# Altium project HAB-Main-Flight-Computer-Card-Template.PrjPcb (part 2 of 4)

## Sheet NetworkSwitch.SchDoc: Main Flight Computer Ethernet Switch
size A2; Revision: 1A; SheetNumber: 3; SheetTotal: 7; Organization: Altium Limited; Address1: Matthew Glazer; Address2: Design Engineer
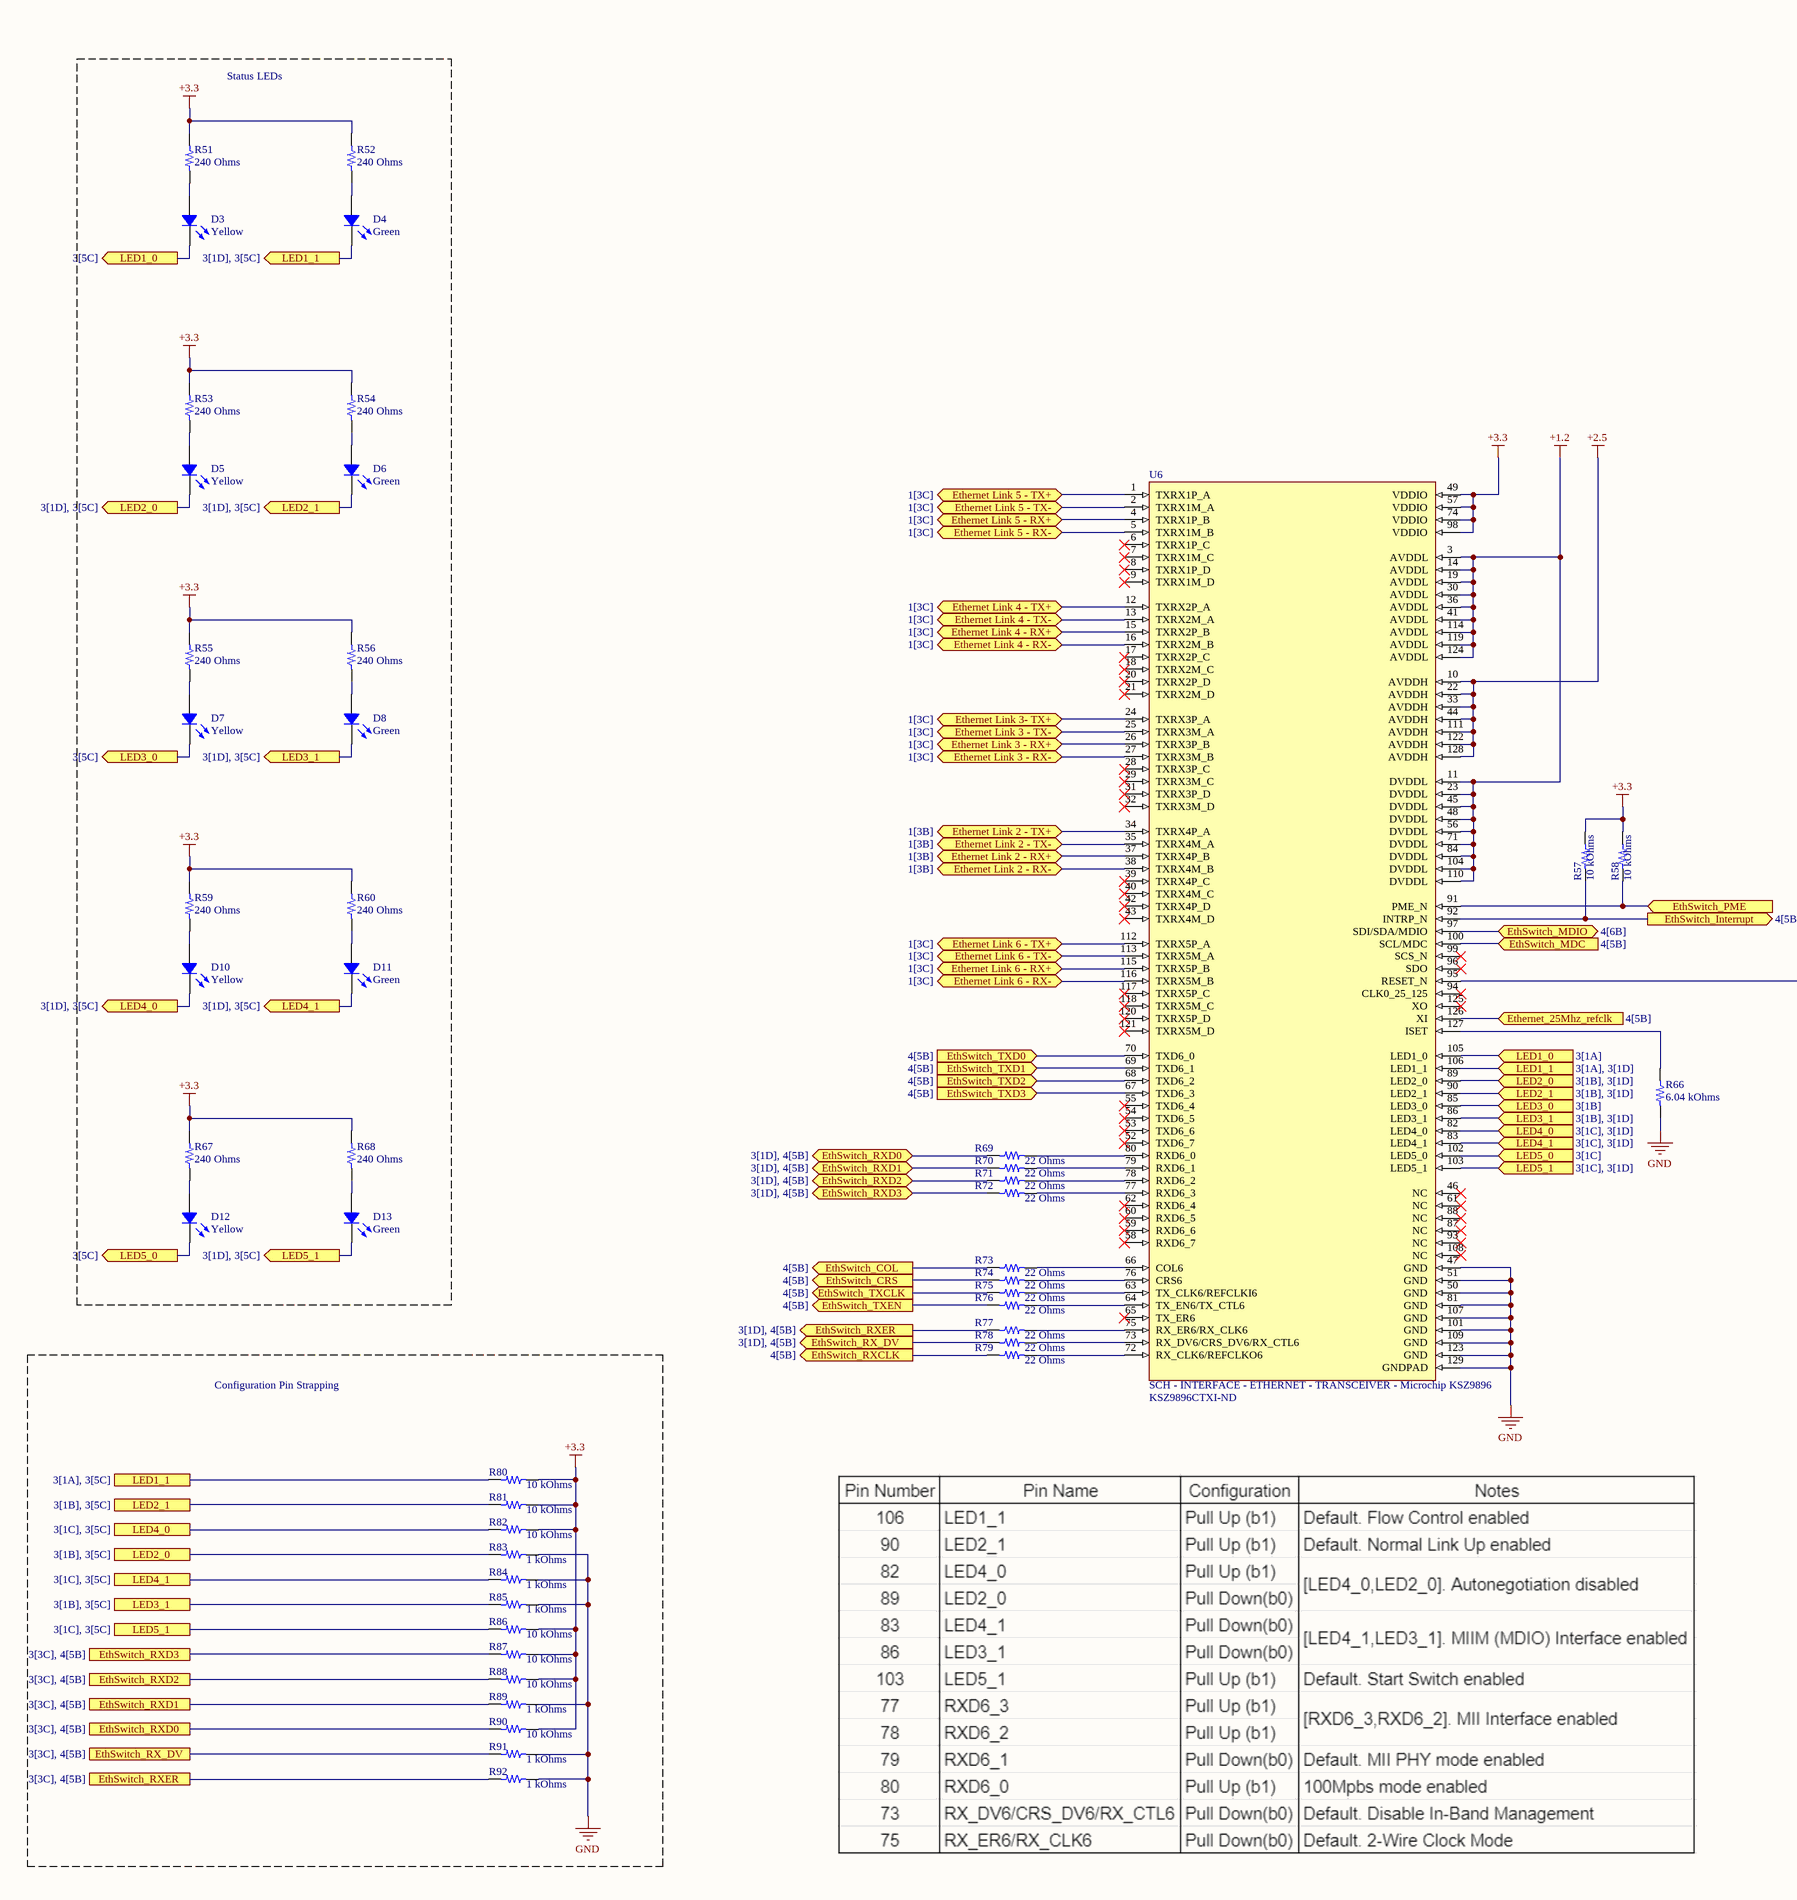
[diagram p2: NetworkSwitch.SchDoc, left]
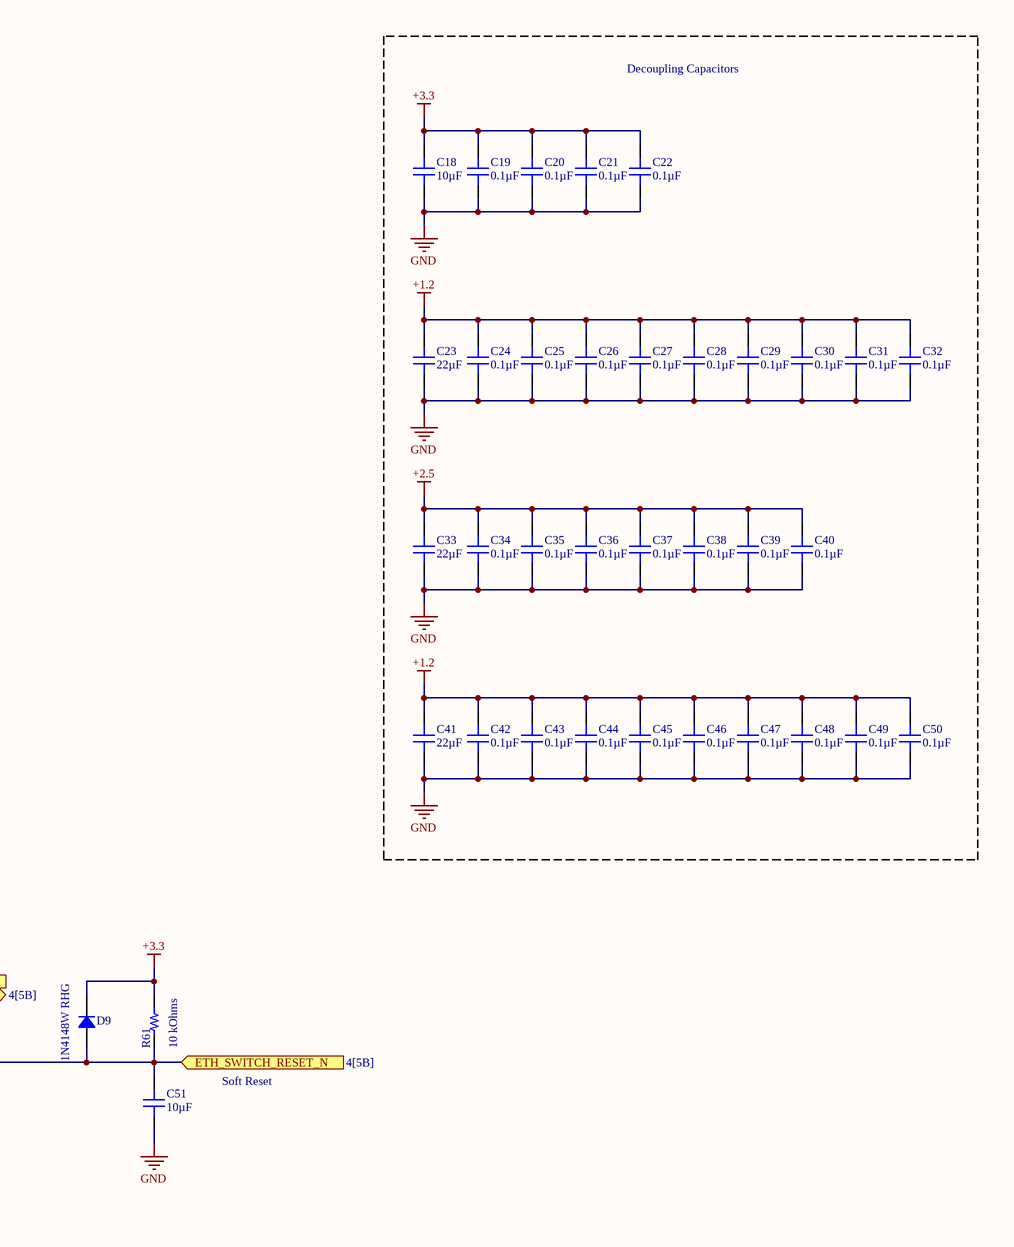
[diagram p3: NetworkSwitch.SchDoc, right]

### Parts
C18  10µF  [CAP 0805_2012]
C19  0.1µF  [CAP 0603_1608]
C20  0.1µF  [CAP 0603_1608]
C21  0.1µF  [CAP 0603_1608]
C22  0.1µF  [CAP 0603_1608]
C23  22µF  [CAP 0805_2012]
C24  0.1µF  [CAP 0603_1608]
C25  0.1µF  [CAP 0603_1608]
C26  0.1µF  [CAP 0603_1608]
C27  0.1µF  [CAP 0603_1608]
C28  0.1µF  [CAP 0603_1608]
C29  0.1µF  [CAP 0603_1608]
C30  0.1µF  [CAP 0603_1608]
C31  0.1µF  [CAP 0603_1608]
C32  0.1µF  [CAP 0603_1608]
C33  22µF  [CAP 0805_2012]
C34  0.1µF  [CAP 0603_1608]
C35  0.1µF  [CAP 0603_1608]
C36  0.1µF  [CAP 0603_1608]
C37  0.1µF  [CAP 0603_1608]
C38  0.1µF  [CAP 0603_1608]
C39  0.1µF  [CAP 0603_1608]
C40  0.1µF  [CAP 0603_1608]
C41  22µF  [CAP 0805_2012]
C42  0.1µF  [CAP 0603_1608]
C43  0.1µF  [CAP 0603_1608]
C44  0.1µF  [CAP 0603_1608]
C45  0.1µF  [CAP 0603_1608]
C46  0.1µF  [CAP 0603_1608]
C47  0.1µF  [CAP 0603_1608]
C48  0.1µF  [CAP 0603_1608]
C49  0.1µF  [CAP 0603_1608]
C50  0.1µF  [CAP 0603_1608]
C51  10µF  [CAP 0805_2012]
D3  Yellow  [LED 0603_1608 YELLOW]
D4  Green  [LED 0603_1608 GREEN]
D5  Yellow  [LED 0603_1608 YELLOW]
D6  Green  [LED 0603_1608 GREEN]
D7  Yellow  [LED 0603_1608 YELLOW]
D8  Green  [LED 0603_1608 GREEN]
D9  1N4148W RHG  [SOD123F]
D10  Yellow  [LED 0603_1608 YELLOW]
D11  Green  [LED 0603_1608 GREEN]
D12  Yellow  [LED 0603_1608 YELLOW]
D13  Green  [LED 0603_1608 GREEN]
R51  240 Ohms  [RES 0603_1608]
R52  240 Ohms  [RES 0603_1608]
R53  240 Ohms  [RES 0603_1608]
R54  240 Ohms  [RES 0603_1608]
R55  240 Ohms  [RES 0603_1608]
R56  240 Ohms  [RES 0603_1608]
R57  10 kOhms  [RES 0603_1608]
R58  10 kOhms  [RES 0603_1608]
R59  240 Ohms  [RES 0603_1608]
R60  240 Ohms  [RES 0603_1608]
R61  10 kOhms  [RES 0603_1608]
R66  6.04 kOhms  [RES 0603_1608]
R67  240 Ohms  [RES 0603_1608]
R68  240 Ohms  [RES 0603_1608]
R69  22 Ohms  [RES 0603_1608]
R70  22 Ohms  [RES 0603_1608]
R71  22 Ohms  [RES 0603_1608]
R72  22 Ohms  [RES 0603_1608]
R73  22 Ohms  [RES 0603_1608]
R74  22 Ohms  [RES 0603_1608]
R75  22 Ohms  [RES 0603_1608]
R76  22 Ohms  [RES 0603_1608]
R77  22 Ohms  [RES 0603_1608]
R78  22 Ohms  [RES 0603_1608]
R79  22 Ohms  [RES 0603_1608]
R80  10 kOhms  [RES 0603_1608]
R81  10 kOhms  [RES 0603_1608]
R82  10 kOhms  [RES 0603_1608]
R83  1 kOhms  [RES 0603_1608]
R84  1 kOhms  [RES 0603_1608]
R85  1 kOhms  [RES 0603_1608]
R86  10 kOhms  [RES 0603_1608]
R87  10 kOhms  [RES 0603_1608]
R88  10 kOhms  [RES 0603_1608]
R89  1 kOhms  [RES 0603_1608]
R90  10 kOhms  [RES 0603_1608]
R91  1 kOhms  [RES 0603_1608]
R92  1 kOhms  [RES 0603_1608]
U6  SCH - INTERFACE - ETHERNET - TRANSCEIVER - Microchip KSZ9896  Supplier Part Number 1: KSZ9896CTXI-ND  [PCB - LEADS - QFP - Microchip 128-TQFP]

### Blocks framed on the sheet
Status LEDs: D3-D8 D10-D13 R51-R56 R59 R60 R67 R68
Decoupling Capacitors: C18-C50
Configuration Pin Strapping: R80-R92

### Ports
ETH_SWITCH_RESET_N (in, see 4[5B]), Ethernet Link 2 - RX+ (bidir, see 1[3B]), Ethernet Link 2 - RX- (bidir, see 1[3B]), Ethernet Link 2 - TX+ (bidir, see 1[3B]), Ethernet Link 2 - TX- (bidir, see 1[3B]), Ethernet Link 3 - RX+ (bidir, see 1[3C]), Ethernet Link 3 - RX- (bidir, see 1[3C]), Ethernet Link 3 - TX- (bidir, see 1[3C]), Ethernet Link 3- TX+ (bidir, see 1[3C]), Ethernet Link 4 - RX+ (bidir, see 1[3C]), Ethernet Link 4 - RX- (bidir, see 1[3C]), Ethernet Link 4 - TX+ (bidir, see 1[3C]), Ethernet Link 4 - TX- (bidir, see 1[3C]), Ethernet Link 5 - RX+ (bidir, see 1[3C]), Ethernet Link 5 - RX- (bidir, see 1[3C]), Ethernet Link 5 - TX+ (bidir, see 1[3C]), Ethernet Link 5 - TX- (bidir, see 1[3C]), Ethernet Link 6 - RX+ (bidir, see 1[3C]), Ethernet Link 6 - RX- (bidir, see 1[3C]), Ethernet Link 6 - TX+ (bidir, see 1[3C]), Ethernet Link 6 - TX- (bidir, see 1[3C]), Ethernet_25Mhz_refclk (in, see 4[5B]), EthSwitch_COL (out, see 4[5B]), EthSwitch_CRS (out, see 4[5B]), EthSwitch_Interrupt (out, see 4[5B]), EthSwitch_MDC (in, see 4[5B]), EthSwitch_MDIO (bidir, see 4[6B]), EthSwitch_PME (in), EthSwitch_RX_DV (out, see 3[1D], 4[5B]), EthSwitch_RX_DV (see 3[3C], 4[5B]), EthSwitch_RXCLK (out, see 4[5B]), EthSwitch_RXD0 (bidir, see 3[1D], 4[5B]), EthSwitch_RXD0 (see 3[3C], 4[5B]), EthSwitch_RXD1 (bidir, see 3[1D], 4[5B]), EthSwitch_RXD1 (see 3[3C], 4[5B]), EthSwitch_RXD2 (bidir, see 3[1D], 4[5B]), EthSwitch_RXD2 (see 3[3C], 4[5B]), EthSwitch_RXD3 (bidir, see 3[1D], 4[5B]), EthSwitch_RXD3 (see 3[3C], 4[5B]), EthSwitch_RXER (out, see 3[1D], 4[5B]), EthSwitch_RXER (see 3[3C], 4[5B]), EthSwitch_TXCLK (out, see 4[5B]), EthSwitch_TXD0 (in, see 4[5B]), EthSwitch_TXD1 (in, see 4[5B]), EthSwitch_TXD2 (in, see 4[5B]), EthSwitch_TXD3 (in, see 4[5B]), EthSwitch_TXEN (out, see 4[5B]), LED1_0 (in, see 3[1A]), LED1_0 (out, see 3[5C]), LED1_1 (in, see 3[1A], 3[1D]), LED1_1 (out, see 3[1D], 3[5C]), LED1_1 (see 3[1A], 3[5C]), LED2_0 (in, see 3[1B], 3[1D]), LED2_0 (out, see 3[1D], 3[5C]), LED2_0 (see 3[1B], 3[5C]), LED2_1 (in, see 3[1B], 3[1D]), LED2_1 (out, see 3[1D], 3[5C]), LED2_1 (see 3[1B], 3[5C]), LED3_0 (in, see 3[1B]), LED3_0 (out, see 3[5C]), LED3_1 (in, see 3[1B], 3[1D]), LED3_1 (out, see 3[1D], 3[5C]), LED3_1 (see 3[1B], 3[5C]), LED4_0 (in, see 3[1C], 3[1D]), LED4_0 (out, see 3[1D], 3[5C]), LED4_0 (see 3[1C], 3[5C]), LED4_1 (in, see 3[1C], 3[1D]), LED4_1 (out, see 3[1D], 3[5C]), LED4_1 (see 3[1C], 3[5C]), LED5_0 (in, see 3[1C]), LED5_0 (out, see 3[5C]), LED5_1 (in, see 3[1C], 3[1D]), LED5_1 (out, see 3[1D], 3[5C]), LED5_1 (see 3[1C], 3[5C])

### Nets
+1.2: C23.2 C24.2 C25.2 C26.2 C27.2 C28.2 C29.2 C30.2 C31.2 C32.2 C41.2 C42.2 C43.2 C44.2 C45.2 C46.2 C47.2 C48.2 C49.2 C50.2 U6.3(AVDDL) U6.11(DVDDL) U6.14(AVDDL) U6.19(AVDDL) U6.23(DVDDL) U6.30(AVDDL) U6.36(AVDDL) U6.41(AVDDL) U6.45(DVDDL) U6.48(DVDDL) U6.56(DVDDL) U6.71(DVDDL) U6.84(DVDDL) U6.104(DVDDL) U6.110(DVDDL) U6.114(AVDDL) U6.119(AVDDL) U6.124(AVDDL)
+2.5: C33.2 C34.2 C35.2 C36.2 C37.2 C38.2 C39.2 C40.2 U6.10(AVDDH) U6.22(AVDDH) U6.33(AVDDH) U6.44(AVDDH) U6.111(AVDDH) U6.122(AVDDH) U6.128(AVDDH)
+3.3: C18.2 C19.2 C20.2 C21.2 C22.2 D9.2 R51.2 R52.2 R53.2 R54.2 R55.2 R56.2 R57.2 R58.2 R59.2 R60.2 R61.2 R67.2 R68.2 R80.1 R81.1 R82.1 R86.1 R87.1 R88.1 R90.1 U6.49(VDDIO) U6.57(VDDIO) U6.74(VDDIO) U6.98(VDDIO)
GND: C18.1 C19.1 C20.1 C21.1 C22.1 C23.1 C24.1 C25.1 C26.1 C27.1 C28.1 C29.1 C30.1 C31.1 C32.1 C33.1 C34.1 C35.1 C36.1 C37.1 C38.1 C39.1 C40.1 C41.1 C42.1 C43.1 C44.1 C45.1 C46.1 C47.1 C48.1 C49.1 C50.1 C51.1 R66.1 R83.1 R84.1 R85.1 R89.1 R91.1 R92.1 U6.47(GND) U6.50(GND) U6.51(GND) U6.81(GND) U6.101(GND) U6.107(GND) U6.109(GND) U6.123(GND) U6.129(GNDPAD)
ETH2_RX_N: U6.38(TXRX4M_B) ; port Ethernet Link 2 - RX-
ETH2_RX_P: U6.37(TXRX4P_B) ; port Ethernet Link 2 - RX+
ETH2_TX_N: U6.35(TXRX4M_A) ; port Ethernet Link 2 - TX-
ETH2_TX_P: U6.34(TXRX4P_A) ; port Ethernet Link 2 - TX+
ETH3_RX_N: U6.27(TXRX3M_B) ; port Ethernet Link 3 - RX-
ETH3_RX_P: U6.26(TXRX3P_B) ; port Ethernet Link 3 - RX+
ETH3_TX_N: U6.25(TXRX3M_A) ; port Ethernet Link 3 - TX-
ETH3_TX_P: U6.24(TXRX3P_A) ; port Ethernet Link 3- TX+
ETH4_RX_N: U6.16(TXRX2M_B) ; port Ethernet Link 4 - RX-
ETH4_RX_P: U6.15(TXRX2P_B) ; port Ethernet Link 4 - RX+
ETH4_TX_N: U6.13(TXRX2M_A) ; port Ethernet Link 4 - TX-
ETH4_TX_P: U6.12(TXRX2P_A) ; port Ethernet Link 4 - TX+
ETH5_RX_N: U6.5(TXRX1M_B) ; port Ethernet Link 5 - RX-
ETH5_RX_P: U6.4(TXRX1P_B) ; port Ethernet Link 5 - RX+
ETH5_TX_N: U6.2(TXRX1M_A) ; port Ethernet Link 5 - TX-
ETH5_TX_P: U6.1(TXRX1P_A) ; port Ethernet Link 5 - TX+
ETH6_RX_N: U6.116(TXRX5M_B) ; port Ethernet Link 6 - RX-
ETH6_RX_P: U6.115(TXRX5P_B) ; port Ethernet Link 6 - RX+
ETH6_TX_N: U6.113(TXRX5M_A) ; port Ethernet Link 6 - TX-
ETH6_TX_P: U6.112(TXRX5P_A) ; port Ethernet Link 6 - TX+
NetC51_2: C51.2 D9.1 R61.1 U6.95(RESET_N) ; port ETH_SWITCH_RESET_N
NetD3_1: D3.1 R51.1
NetD3_2: D3.2 U6.105(LED1_0) ; port LED1_0
NetD4_1: D4.1 R52.1
NetD4_2: D4.2 R80.2 U6.106(LED1_1) ; port LED1_1
NetD5_1: D5.1 R53.1
NetD5_2: D5.2 R83.2 U6.89(LED2_0) ; port LED2_0
NetD6_1: D6.1 R54.1
NetD6_2: D6.2 R81.2 U6.90(LED2_1) ; port LED2_1
NetD7_1: D7.1 R55.1
NetD7_2: D7.2 U6.85(LED3_0) ; port LED3_0
NetD8_1: D8.1 R56.1
NetD8_2: D8.2 R85.2 U6.86(LED3_1) ; port LED3_1
NetD10_1: D10.1 R59.1
NetD10_2: D10.2 R82.2 U6.82(LED4_0) ; port LED4_0
NetD11_1: D11.1 R60.1
NetD11_2: D11.2 R84.2 U6.83(LED4_1) ; port LED4_1
NetD12_1: D12.1 R67.1
NetD12_2: D12.2 U6.102(LED5_0) ; port LED5_0
NetD13_1: D13.1 R68.1
NetD13_2: D13.2 R86.2 U6.103(LED5_1) ; port LED5_1
NetR57_1: R57.1 U6.92(INTRP_N) ; port EthSwitch_Interrupt
NetR58_1: R58.1 U6.91(PME_N) ; port EthSwitch_PME
NetR62_2: U6.70(TXD6_0) ; port EthSwitch_TXD0
NetR63_2: U6.69(TXD6_1) ; port EthSwitch_TXD1
NetR64_2: U6.68(TXD6_2) ; port EthSwitch_TXD2
NetR65_2: U6.67(TXD6_3) ; port EthSwitch_TXD3
NetR66_2: R66.2 U6.127(ISET)
NetR69_1: R69.1 R90.2 ; port EthSwitch_RXD0
NetR69_2: R69.2 U6.80(RXD6_0)
NetR70_1: R70.1 R89.2 ; port EthSwitch_RXD1
NetR70_2: R70.2 U6.79(RXD6_1)
NetR71_1: R71.1 R88.2 ; port EthSwitch_RXD2
NetR71_2: R71.2 U6.78(RXD6_2)
NetR72_1: R72.1 R87.2 ; port EthSwitch_RXD3
NetR72_2: R72.2 U6.77(RXD6_3)
NetR73_1: R73.1 ; port EthSwitch_COL
NetR73_2: R73.2 U6.66(COL6)
NetR74_1: R74.1 ; port EthSwitch_CRS
NetR74_2: R74.2 U6.76(CRS6)
NetR75_1: R75.1 ; port EthSwitch_TXCLK
NetR75_2: R75.2 U6.63(TX_CLK6/REFCLKI6)
NetR76_1: R76.1 ; port EthSwitch_TXEN
NetR76_2: R76.2 U6.64(TX_EN6/TX_CTL6)
NetR77_1: R77.1 R92.2 ; port EthSwitch_RXER
NetR77_2: R77.2 U6.75(RX_ER6/RX_CLK6)
NetR78_1: R78.1 R91.2 ; port EthSwitch_RX_DV
NetR78_2: R78.2 U6.73(RX_DV6/CRS_DV6/RX_CTL6)
NetR79_1: R79.1 ; port EthSwitch_RXCLK
NetR79_2: R79.2 U6.72(RX_CLK6/REFCLKO6)
NetR131_1: U6.97(SDI/SDA/MDIO) ; port EthSwitch_MDIO
NetU6_100: U6.100(SCL/MDC) ; port EthSwitch_MDC
NetU6_126: U6.126(XI) ; port Ethernet_25Mhz_refclk

Not connected (* = marked no-connect by the designer): U6 6(TXRX1P_C)* 7(TXRX1M_C)* 8(TXRX1P_D)* 9(TXRX1M_D)* 17(TXRX2P_C)* 18(TXRX2M_C)* 20(TXRX2P_D)* 21(TXRX2M_D)* 28(TXRX3P_C)* 29(TXRX3M_C)* 31(TXRX3P_D)* 32(TXRX3M_D)* 39(TXRX4P_C)* 40(TXRX4M_C)* 42(TXRX4P_D)* 43(TXRX4M_D)* 46(NC)* 52(TXD6_7)* 53(TXD6_6)* 54(TXD6_5)* 55(TXD6_4)* 58(RXD6_7)* 59(RXD6_6)* 60(RXD6_5)* 61(NC)* 62(RXD6_4)* 65(TX_ER6)* 87(NC)* 88(NC)* 93(NC)* 94(CLK0_25_125)* 96(SDO)* 99(SCS_N)* 108(NC)* 117(TXRX5P_C)* 118(TXRX5M_C)* 120(TXRX5P_D)* 121(TXRX5M_D)* 125(XO)*

### Notes on the sheet
- Soft Reset
- Title
- Size:
- Date:
- File:
- A2
- Number:
- Time:
- Revision:
- Sheet
- of

### Library data of the parts
C18 C51 = CC0805KKX5R7BB106: CAP CER 10UF 16V X5R 0805; Manufacturer: Yageo; Tolerance: ±10%; Part Number: CC0805KKX5R7BB106; Value: 10µF; Applications: General Purpose; Capacitance: 10µF; ComponentLink1Description: Datasheet; ComponentLink1URL: https://www.yageo.com/upload/media/product/productsearch/datasheet/mlcc/UPY-GPHC_X5R_4V-to-50V_25.pdf; ComponentLink2Description: DigiKey Link; ComponentLink2URL: http://digikey.com/product-detail/en/yageo/CC0805KKX5R7BB106/311-1865-1-ND/5195767; Device Package: 0805 (2012 Metric); LastUpdated: 9/2/2020 1:04:30 AM; Lifecycle Status: Active; Minimum Order: 1; Mounting Type: Surface Mount, MLCC; Operating Temperature: -55°C ~ 85°C; Package / Case: 0805 (2012 Metric); Packaging: TapeAndReel; PartId: 8867; Part Status: Active; Price: 0.09; Series: CC; Size / Dimension: 0.079" L x 0.049" W (2.00mm x 1.25mm); Supplier 1: DigiKey; Supplier Part Number 1: 311-1865-1-ND; Temperature Coefficient: X5R; Thickness (Max): 0.057" (1.45mm); Voltage - Rated: 16V
C19-C22 C24-C32 C34-C40 C42-C50 = CL10B104KA8WPNC: CAP CER 0.1UF 25V X7R 0603; Manufacturer: Samsung Electro-Mechanics; Tolerance: ±10%; Part Number: CL10B104KA8WPNC; Value: 0.1µF; Applications: Automotive; Capacitance: 0.1µF; ComponentLink1Description: Datasheet; ComponentLink1URL: http://www.samsungsem.com/kr/support/product-search/mlcc/CL10B104KA8WPNC.jsp; ComponentLink2Description: DigiKey Link; ComponentLink2URL: http://digikey.com/product-detail/en/samsung-electro-mechanics/CL10B104KA8WPNC/1276-6717-1-ND/5961576; Device Package: 0603 (1608 Metric); Features: Open Mode; LastUpdated: 9/2/2020 1:03:30 AM; Lifecycle Status: Active; Minimum Order: 1; Mounting Type: Surface Mount, MLCC; Operating Temperature: -55°C ~ 125°C; Package / Case: 0603 (1608 Metric); Packaging: TapeAndReel; PartId: 5631; Part Status: Active; Price: 0.02; Ratings: AEC-Q200; Series: CL; Size / Dimension: 0.063" L x 0.031" W (1.60mm x 0.80mm); Supplier 1: DigiKey; Supplier Part Number 1: 1276-6717-1-ND; Temperature Coefficient: X7R; Thickness (Max): 0.035" (0.90mm); Voltage - Rated: 25V
C23 C33 C41 = CL21A226KPCLRNC: CAP CER 22UF 10V X5R 0805; Manufacturer: Samsung Electro-Mechanics; Tolerance: ±10%; Part Number: CL21A226KPCLRNC; Value: 22µF; Applications: General Purpose; Capacitance: 22µF; ComponentLink1Description: Datasheet; ComponentLink1URL: http://www.samsungsem.com/kr/support/product-search/mlcc/CL21A226KPCLRNC.jsp; ComponentLink2Description: DigiKey Link; ComponentLink2URL: http://digikey.com/product-detail/en/samsung-electro-mechanics/CL21A226KPCLRNC/1276-6786-1-ND/5961645; Device Package: 0805 (2012 Metric); Features: Low Profile; LastUpdated: 9/2/2020 1:04:38 AM; Lifecycle Status: Active; Minimum Order: 1; Mounting Type: Surface Mount, MLCC; Operating Temperature: -55°C ~ 85°C; Package / Case: 0805 (2012 Metric); Packaging: TapeAndReel; PartId: 4833; Part Status: Active; Price: 0.08; Series: CL; Size / Dimension: 0.079" L x 0.049" W (2.00mm x 1.25mm); Supplier 1: DigiKey; Supplier Part Number 1: 1276-6786-1-ND; Temperature Coefficient: X5R; Thickness (Max): 0.037" (0.95mm); Voltage - Rated: 10V
D3 D5 D7 D10 D12 = LTST-C191KSKT: LED YELLOW CLEAR SMD; Manufacturer: Lite-On Inc.; Configuration: Standard; Current - Test: 20mA; Lens Color: Colorless; Lens Size: 1.10mm x 0.80mm; Lens Style: Rectangle with Flat Top; Millicandela Rating: 104mcd; Viewing Angle: 130°; Voltage - Forward (Vf) (Typ): 2.1V; Wavelength - Dominant: 591nm; Wavelength - Peak: 588nm; Part Number: LTST-C191KSKT; Color: Yellow; ComponentLink1Description: Datasheet; ComponentLink1URL: http://optoelectronics.liteon.com/upload/download/DS22-2000-224/LTST-C191KSKT.PDF; ComponentLink2Description: DigiKey Link; ComponentLink2URL: http://digikey.com/product-detail/en/lite-on-inc/LTST-C191KSKT/160-1448-1-ND/386838; Device Package: 0603 (1608 Metric); Height (Max): 0.65mm; LastUpdated: 9/2/2020 1:21:17 AM; Lens Transparency: Clear; Lifecycle Status: Active; Minimum Order: 1; Mounting Type: Surface Mount; Package / Case: 0603 (1608 Metric); Packaging: TapeAndReel; PartId: 132; Part Status: Active; Price: 0.04; Series: -; Size / Dimension: 1.60mm L x 0.80mm W; Supplier 1: DigiKey; Supplier Part Number 1: 160-1448-1-ND; Value: Yellow
D4 D6 D8 D11 D13 = LTST-C193KGKT-5A: LED GREEN CLEAR CHIP SMD; Manufacturer: Lite-On Inc.; Configuration: Standard; Current - Test: 5mA; Lens Color: Colorless; Lens Size: 1.15mm x 0.80mm; Lens Style: Rectangle with Flat Top; Millicandela Rating: 16.25mcd; Viewing Angle: 130°; Voltage - Forward (Vf) (Typ): 2V; Wavelength - Dominant: 572nm; Wavelength - Peak: 574nm; Part Number: LTST-C193KGKT-5A; Color: Green; ComponentLink1Description: Datasheet; ComponentLink1URL: http://optoelectronics.liteon.com/upload/download/DS22-2007-0094/LTST-C193KGKT-5A.PDF; ComponentLink2Description: DigiKey Link; ComponentLink2URL: http://digikey.com/product-detail/en/lite-on-inc/LTST-C193KGKT-5A/160-1828-1-ND/2356247; Device Package: 0603 (1608 Metric); Height (Max): 0.45mm; LastUpdated: 9/2/2020 1:20:41 AM; Lens Transparency: Clear; Lifecycle Status: Active; Minimum Order: 1; Mounting Type: Surface Mount; Package / Case: 0603 (1608 Metric); Packaging: TapeAndReel; PartId: 694; Part Status: Active; Price: 0.06; Series: -; Size / Dimension: 1.60mm L x 0.80mm W; Supplier 1: DigiKey; Supplier Part Number 1: 160-1828-1-ND; Supplier Device Package: Chip LED; Value: Green
D9 = 1N4148W RHG: DIODE GEN PURP 100V 150MA SOD123; Manufacturer: Taiwan Semiconductor Corporation; Current - Average Rectified (Io): 150mA (DC); Current - Reverse Leakage @ Vr: 5µA @ 75V; Diode Type: Standard; Reverse Recovery Time (trr): 4ns; Speed: Fast Recovery =< 500ns, > 200mA (Io); Voltage - Forward (Vf) (Max) @ If: 1V @ 100mA; Part Number: 1N4148W RHG; ComponentLink1Description: Datasheet; ComponentLink1URL: https://www.taiwansemi.com/products/datasheet/1N4148W%20SERIES_K1804.pdf; ComponentLink2Description: DigiKey Link; ComponentLink2URL: http://digikey.com/product-detail/en/taiwan-semiconductor-corporation/1N4148W-RHG/1N4148WRHGCT-ND/7357066; LastUpdated: 9/2/2020 1:19:10 AM; Lifecycle Status: Active; Minimum Order: 1; Mounting Type: Surface Mount; Operating Temperature - Junction: -65°C ~ 150°C; Package / Case: SOD-123F; Packaging: TapeAndReel; PartId: 1073; Part Status: Active; Price: 0.03; Series: -; Supplier 1: DigiKey; Supplier Part Number 1: 1N4148WRHGCT-ND; Supplier Device Package: SOD-123F; Voltage - DC Reverse (Vr) (Max): 100V
R51-R56 R59 R60 R67 R68 = RMCF0603JT240R: RES 240 OHM 5% 1/10W 0603; Manufacturer: Stackpole Electronics Inc; Power (Watts): 0.1W, 1/10W; Temperature Coefficient: ±200ppm/°C; Part Number: RMCF0603JT240R; Value: 240 Ohms; ComponentLink1Description: Datasheet; ComponentLink1URL: https://www.seielect.com/catalog/sei-rmcf_rmcp.pdf; ComponentLink2Description: DigiKey Link; ComponentLink2URL: http://digikey.com/product-detail/en/stackpole-electronics-inc/RMCF0603JT240R/RMCF0603JT240RCT-ND/2418189; Composition: Thick Film; Device Package: 0603 (1608 Metric); Features: Automotive AEC-Q200; Height - Seated (Max): 0.022" (0.55mm); LastUpdated: 9/2/2020 1:10:22 AM; Lifecycle Status: Active; Minimum Order: 1; Number of Terminations: 2; Operating Temperature: -55°C ~ 155°C; Package / Case: 0603 (1608 Metric); Packaging: CutTape; PartId: 5995; Part Status: Active; Price: 0.10; Ratings: AEC-Q200; Resistance: 240 Ohms; Series: RMCF; Size / Dimension: 0.061" L x 0.031" W (1.55mm x 0.80mm); Supplier 1: DigiKey; Supplier Part Number 1: RMCF0603JT240RCT-ND; Supplier Device Package: 0603; Tolerance: ±5%
R57 R58 R61 R80-R82 R86-R88 R90 = RMCF0603JT10K0: RES 10K OHM 5% 1/10W 0603; Manufacturer: Stackpole Electronics Inc; Power (Watts): 0.1W, 1/10W; Temperature Coefficient: ±200ppm/°C; Part Number: RMCF0603JT10K0; Value: 10 kOhms; ComponentLink1Description: Datasheet; ComponentLink1URL: https://www.seielect.com/catalog/sei-packaging.pdf; ComponentLink2Description: DigiKey Link; ComponentLink2URL: http://digikey.com/product-detail/en/stackpole-electronics-inc/RMCF0603JT10K0/RMCF0603JT10K0CT-ND/1943191; Composition: Thick Film; Device Package: 0603 (1608 Metric); Features: Automotive AEC-Q200; Height - Seated (Max): 0.022" (0.55mm); LastUpdated: 9/2/2020 1:09:31 AM; Lifecycle Status: Active; Minimum Order: 1; Number of Terminations: 2; Operating Temperature: -55°C ~ 155°C; Package / Case: 0603 (1608 Metric); Packaging: CutTape; PartId: 25659; Part Status: Active; Price: 0.10; Ratings: AEC-Q200; Resistance: 10 kOhms; Series: RMCF; Size / Dimension: 0.061" L x 0.031" W (1.55mm x 0.80mm); Supplier 1: DigiKey; Supplier Part Number 1: RMCF0603JT10K0CT-ND; Supplier Device Package: 0603; Tolerance: ±5%
R66 = RMCF0603FT6K04: RES 6.04K OHM 1% 1/10W 0603; Manufacturer: Stackpole Electronics Inc; Power (Watts): 0.1W, 1/10W; Temperature Coefficient: ±100ppm/°C; Part Number: RMCF0603FT6K04; Value: 6.04 kOhms; ComponentLink1Description: Datasheet; ComponentLink1URL: https://www.seielect.com/catalog/sei-rmcf_rmcp.pdf; ComponentLink2Description: DigiKey Link; ComponentLink2URL: http://digikey.com/product-detail/en/stackpole-electronics-inc/RMCF0603FT6K04/RMCF0603FT6K04CT-ND/1943041; Composition: Thick Film; Device Package: 0603 (1608 Metric); Features: Automotive AEC-Q200; Height - Seated (Max): 0.022" (0.55mm); LastUpdated: 9/2/2020 1:10:13 AM; Lifecycle Status: Active; Minimum Order: 1; Number of Terminations: 2; Operating Temperature: -55°C ~ 155°C; Package / Case: 0603 (1608 Metric); Packaging: CutTape; PartId: 10873; Part Status: Active; Price: 0.10; Ratings: AEC-Q200; Resistance: 6.04 kOhms; Series: RMCF; Size / Dimension: 0.061" L x 0.031" W (1.55mm x 0.80mm); Supplier 1: DigiKey; Supplier Part Number 1: RMCF0603FT6K04CT-ND; Supplier Device Package: 0603; Tolerance: ±1%
R69-R79 = RMCF0603FT22R0: RES 22 OHM 1% 1/10W 0603; Manufacturer: Stackpole Electronics Inc; Power (Watts): 0.1W, 1/10W; Temperature Coefficient: ±100ppm/°C; Part Number: RMCF0603FT22R0; Value: 22 Ohms; ComponentLink1Description: Datasheet; ComponentLink1URL: https://www.seielect.com/catalog/sei-packaging.pdf; ComponentLink2Description: DigiKey Link; ComponentLink2URL: http://digikey.com/product-detail/en/stackpole-electronics-inc/RMCF0603FT22R0/RMCF0603FT22R0CT-ND/1942946; Composition: Thick Film; Device Package: 0603 (1608 Metric); Features: Automotive AEC-Q200; Height - Seated (Max): 0.022" (0.55mm); LastUpdated: 9/2/2020 1:10:13 AM; Lifecycle Status: Active; Minimum Order: 1; Number of Terminations: 2; Operating Temperature: -55°C ~ 155°C; Package / Case: 0603 (1608 Metric); Packaging: CutTape; PartId: 10611; Part Status: Active; Price: 0.10; Ratings: AEC-Q200; Resistance: 22 Ohms; Series: RMCF; Size / Dimension: 0.061" L x 0.031" W (1.55mm x 0.80mm); Supplier 1: DigiKey; Supplier Part Number 1: RMCF0603FT22R0CT-ND; Supplier Device Package: 0603; Tolerance: ±1%
R83-R85 R89 R91 R92 = RNCP0603FTD1K00: RES 1K OHM 1% 1/8W 0603; Manufacturer: Stackpole Electronics Inc; Power (Watts): 0.125W, 1/8W; Temperature Coefficient: ±100ppm/°C; Part Number: RNCP0603FTD1K00; Value: 1 kOhms; ComponentLink1Description: Datasheet; ComponentLink1URL: https://www.seielect.com/catalog/sei-rncp.pdf; ComponentLink2Description: DigiKey Link; ComponentLink2URL: http://digikey.com/product-detail/en/stackpole-electronics-inc/RNCP0603FTD1K00/RNCP0603FTD1K00CT-ND/2240445; Composition: Thin Film; Device Package: 0603 (1608 Metric); Features: Anti-Sulfur, Moisture Resistant; Height - Seated (Max): 0.020" (0.50mm); LastUpdated: 9/2/2020 1:10:23 AM; Lifecycle Status: Active; Minimum Order: 1; Number of Terminations: 2; Operating Temperature: -55°C ~ 155°C; Package / Case: 0603 (1608 Metric); Packaging: TapeAndReel; PartId: 5694; Part Status: Active; Price: 0.01; Resistance: 1 kOhms; Series: RNCP; Size / Dimension: 0.059" L x 0.031" W (1.50mm x 0.80mm); Supplier 1: DigiKey; Supplier Part Number 1: RNCP0603FTD1K00CT-ND; Supplier Device Package: 0603; Tolerance: ±1%
U6 = SCH - INTERFACE - ETHERNET - TRANSCEIVER - Microchip KSZ9896: Supplier 1: Digi-Key

## Sheet EthernetBridge.SchDoc: Main Flight Computer Ethernet Bridge
size A2; Organization: Brickworks; Address1: Matthew Glazer; Address2: Design Engineer; Revision: 1A; SheetNumber: 4; SheetTotal: 7
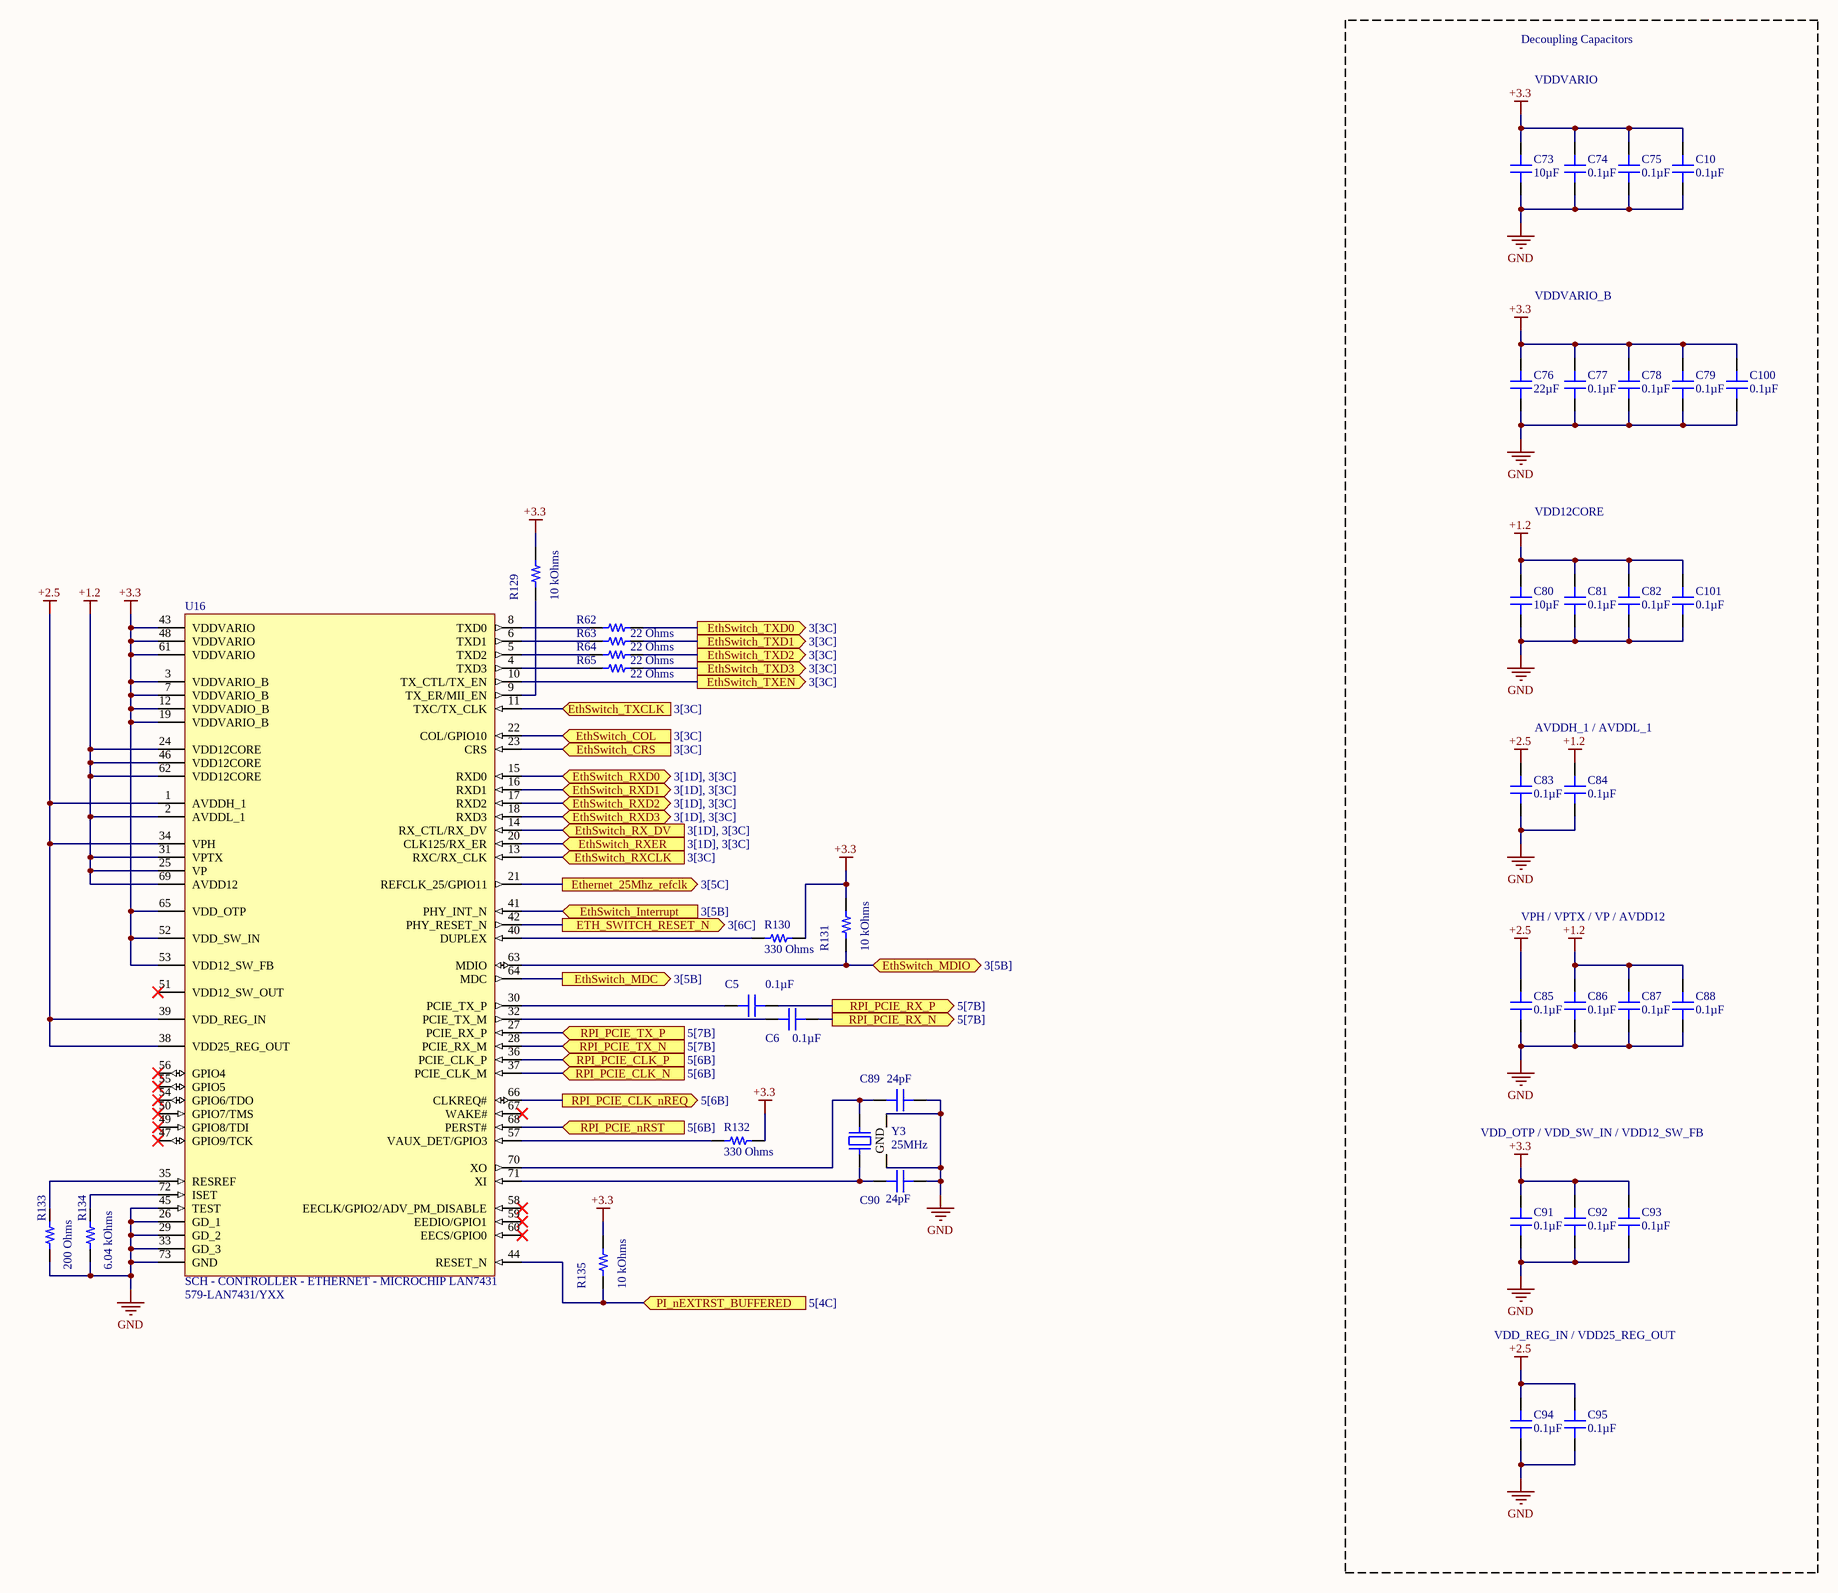
[diagram p4: EthernetBridge.SchDoc]

### Parts
C5  0.1µF  [CAP 0603_1608]
C6  0.1µF  [CAP 0603_1608]
C10  0.1µF  [CAP 0603_1608]
C73  10µF  [CAP 0805_2012]
C74  0.1µF  [CAP 0603_1608]
C75  0.1µF  [CAP 0603_1608]
C76  22µF  [CAP 0805_2012]
C77  0.1µF  [CAP 0603_1608]
C78  0.1µF  [CAP 0603_1608]
C79  0.1µF  [CAP 0603_1608]
C80  10µF  [CAP 0805_2012]
C81  0.1µF  [CAP 0603_1608]
C82  0.1µF  [CAP 0603_1608]
C83  0.1µF  [CAP 0603_1608]
C84  0.1µF  [CAP 0603_1608]
C85  0.1µF  [CAP 0603_1608]
C86  0.1µF  [CAP 0603_1608]
C87  0.1µF  [CAP 0603_1608]
C88  0.1µF  [CAP 0603_1608]
C89  24pF  [CAP 0603_1608]
C90  24pF  [CAP 0603_1608]
C91  0.1µF  [CAP 0603_1608]
C92  0.1µF  [CAP 0603_1608]
C93  0.1µF  [CAP 0603_1608]
C94  0.1µF  [CAP 0603_1608]
C95  0.1µF  [CAP 0603_1608]
C100  0.1µF  [CAP 0603_1608]
C101  0.1µF  [CAP 0603_1608]
R62  22 Ohms  [RES 0603_1608]
R63  22 Ohms  [RES 0603_1608]
R64  22 Ohms  [RES 0603_1608]
R65  22 Ohms  [RES 0603_1608]
R129  10 kOhms  [RES 0603_1608]
R130  330 Ohms  [RES 0603_1608]
R131  10 kOhms  [RES 0603_1608]
R132  330 Ohms  [RES 0603_1608]
R133  200 Ohms  [RES 0603_1608]
R134  6.04 kOhms  [RES 0603_1608]
R135  10 kOhms  [RES 0603_1608]
U16  SCH - CONTROLLER - ETHERNET - MICROCHIP LAN7431  Supplier Part Number 1: 579-LAN7431/YXX  [PCB - LEADLESS - QFN - MICROCHIP 72-SQFN]
Y3  25MHz  [EPSON TSX-3225]

### Ports
ETH_SWITCH_RESET_N (out, see 3[6C]), Ethernet_25Mhz_refclk (out, see 3[5C]), EthSwitch_COL (in, see 3[3C]), EthSwitch_CRS (in, see 3[3C]), EthSwitch_Interrupt (in, see 3[5B]), EthSwitch_MDC (out, see 3[5B]), EthSwitch_MDIO (bidir, see 3[5B]), EthSwitch_RX_DV (in, see 3[1D], 3[3C]), EthSwitch_RXCLK (in, see 3[3C]), EthSwitch_RXD0 (bidir, see 3[1D], 3[3C]), EthSwitch_RXD1 (bidir, see 3[1D], 3[3C]), EthSwitch_RXD2 (bidir, see 3[1D], 3[3C]), EthSwitch_RXD3 (bidir, see 3[1D], 3[3C]), EthSwitch_RXER (in, see 3[1D], 3[3C]), EthSwitch_TXCLK (in, see 3[3C]), EthSwitch_TXD0 (out, see 3[3C]), EthSwitch_TXD1 (out, see 3[3C]), EthSwitch_TXD2 (out, see 3[3C]), EthSwitch_TXD3 (out, see 3[3C]), EthSwitch_TXEN (out, see 3[3C]), PI_nEXTRST_BUFFERED (in, see 5[4C]), RPI_PCIE_CLK_N (in, see 5[6B]), RPI_PCIE_CLK_nREQ (out, see 5[6B]), RPI_PCIE_CLK_P (in, see 5[6B]), RPI_PCIE_nRST (in, see 5[6B]), RPI_PCIE_RX_N (out, see 5[7B]), RPI_PCIE_RX_P (out, see 5[7B]), RPI_PCIE_TX_N (in, see 5[7B]), RPI_PCIE_TX_P (in, see 5[7B])

### Nets
+1.2: C80.2 C81.2 C82.2 C84.2 C86.2 C87.2 C88.2 C101.2 U16.2(AVDDL_1) U16.24(VDD12CORE) U16.25(VP) U16.31(VPTX) U16.46(VDD12CORE) U16.62(VDD12CORE) U16.69(AVDD12)
+2.5: C83.2 C85.2 C94.2 C95.2 U16.1(AVDDH_1) U16.34(VPH) U16.38(VDD25_REG_OUT) U16.39(VDD_REG_IN)
+3.3: C10.2 C73.2 C74.2 C75.2 C76.2 C77.2 C78.2 C79.2 C91.2 C92.2 C93.2 C100.2 R129.2 R130.1 R131.2 R132.2 R135.2 U16.3(VDDVARIO_B) U16.7(VDDVARIO_B) U16.12(VDDVADIO_B) U16.19(VDDVARIO_B) U16.43(VDDVARIO) U16.48(VDDVARIO) U16.52(VDD_SW_IN) U16.53(VDD12_SW_FB) U16.61(VDDVARIO) U16.65(VDD_OTP)
GND: C10.1 C73.1 C74.1 C75.1 C76.1 C77.1 C78.1 C79.1 C80.1 C81.1 C82.1 C83.1 C84.1 C85.1 C86.1 C87.1 C88.1 C89.2 C90.2 C91.1 C92.1 C93.1 C94.1 C95.1 C100.1 C101.1 R133.1 R134.1 U16.26(GD_1) U16.29(GD_2) U16.33(GD_3) U16.45(TEST) U16.73(GND) Y3.2(GND) Y3.4(GND)
NetC5_1: C5.1 ; port RPI_PCIE_RX_P
NetC5_2: C5.2 U16.30(PCIE_TX_P)
NetC6_1: C6.1 ; port RPI_PCIE_RX_N
NetC6_2: C6.2 U16.32(PCIE_TX_M)
NetC51_2: U16.42(PHY_RESET_N) ; port ETH_SWITCH_RESET_N
NetC89_1: C89.1 U16.70(XO) Y3.3
NetC90_1: C90.1 U16.71(XI) Y3.1
NetR57_1: U16.41(PHY_INT_N) ; port EthSwitch_Interrupt
NetR62_1: R62.1 U16.8(TXD0)
NetR62_2: R62.2 ; port EthSwitch_TXD0
NetR63_1: R63.1 U16.6(TXD1)
NetR63_2: R63.2 ; port EthSwitch_TXD1
NetR64_1: R64.1 U16.5(TXD2)
NetR64_2: R64.2 ; port EthSwitch_TXD2
NetR65_1: R65.1 U16.4(TXD3)
NetR65_2: R65.2 ; port EthSwitch_TXD3
NetR69_1: U16.15(RXD0) ; port EthSwitch_RXD0
NetR70_1: U16.16(RXD1) ; port EthSwitch_RXD1
NetR71_1: U16.17(RXD2) ; port EthSwitch_RXD2
NetR72_1: U16.18(RXD3) ; port EthSwitch_RXD3
NetR73_1: U16.22(COL/GPIO10) ; port EthSwitch_COL
NetR74_1: U16.23(CRS) ; port EthSwitch_CRS
NetR75_1: U16.11(TXC/TX_CLK) ; port EthSwitch_TXCLK
NetR76_1: U16.10(TX_CTL/TX_EN) ; port EthSwitch_TXEN
NetR77_1: U16.20(CLK125/RX_ER) ; port EthSwitch_RXER
NetR78_1: U16.14(RX_CTL/RX_DV) ; port EthSwitch_RX_DV
NetR79_1: U16.13(RXC/RX_CLK) ; port EthSwitch_RXCLK
NetR129_1: R129.1 U16.9(TX_ER/MII_EN)
NetR130_2: R130.2 U16.40(DUPLEX)
NetR131_1: R131.1 U16.63(MDIO) ; port EthSwitch_MDIO
NetR132_1: R132.1 U16.57(VAUX_DET/GPIO3)
NetR133_2: R133.2 U16.35(RESREF)
NetR134_2: R134.2 U16.72(ISET)
NetR135_1: R135.1 U16.44(RESET_N) ; port PI_nEXTRST_BUFFERED
NetU1_102: U16.66(CLKREQ#) ; port RPI_PCIE_CLK_nREQ
NetU1_109: U16.68(PERST#) ; port RPI_PCIE_nRST
NetU1_110: U16.36(PCIE_CLK_P) ; port RPI_PCIE_CLK_P
NetU1_112: U16.37(PCIE_CLK_M) ; port RPI_PCIE_CLK_N
NetU1_122: U16.27(PCIE_RX_P) ; port RPI_PCIE_TX_P
NetU1_124: U16.28(PCIE_RX_M) ; port RPI_PCIE_TX_N
NetU6_100: U16.64(MDC) ; port EthSwitch_MDC
NetU6_126: U16.21(REFCLK_25/GPIO11) ; port Ethernet_25Mhz_refclk

Not connected (* = marked no-connect by the designer): U16 47(GPIO9/TCK)* 49(GPIO8/TDI)* 50(GPIO7/TMS)* 51(VDD12_SW_OUT)* 54(GPIO6/TDO)* 55(GPIO5)* 56(GPIO4)* 58(EECLK/GPIO2/ADV_PM_DISABLE)* 59(EEDIO/GPIO1)* 60(EECS/GPIO0)* 67(WAKE#)*

### Notes on the sheet
- Decoupling Capacitors
- VDDVARIO
- VDDVARIO_B
- VDD12CORE
- AVDDH_1 / AVDDL_1
- VPH / VPTX / VP / AVDD12
- VDD_OTP / VDD_SW_IN / VDD12_SW_FB
- VDD_REG_IN / VDD25_REG_OUT
- Title
- Size:
- Date:
- File:
- A2
- Number:
- Time:
- Revision:
- Sheet
- of

### Library data of the parts
C5 C6 C10 C74 C75 C77-C79 C81-C88 C91-C95 C100 C101 = CL10B104KA8WPNC: as C19 on sheet NetworkSwitch; Part Number: CL10B104KA8WPNC; Value: 0.1µF; Applications: Automotive; Capacitance: 0.1µF; ComponentLink1Description: Datasheet; ComponentLink1URL: http://www.samsungsem.com/kr/support/product-search/mlcc/CL10B104KA8WPNC.jsp; ComponentLink2Description: DigiKey Link; ComponentLink2URL: http://digikey.com/product-detail/en/samsung-electro-mechanics/CL10B104KA8WPNC/1276-6717-1-ND/5961576; Device Package: 0603 (1608 Metric); Features: Open Mode; LastUpdated: 9/2/2020 1:03:30 AM; Lifecycle Status: Active; Minimum Order: 1; Mounting Type: Surface Mount, MLCC; Operating Temperature: -55°C ~ 125°C; Package / Case: 0603 (1608 Metric); Packaging: TapeAndReel; PartId: 5631; Part Status: Active; Price: 0.02; Ratings: AEC-Q200; Series: CL; Size / Dimension: 0.063" L x 0.031" W (1.60mm x 0.80mm); Supplier 1: DigiKey; Supplier Part Number 1: 1276-6717-1-ND; Temperature Coefficient: X7R; Thickness (Max): 0.035" (0.90mm); Voltage - Rated: 25V
C73 C80 = CC0805KKX5R7BB106: as C18 on sheet NetworkSwitch; Part Number: CC0805KKX5R7BB106; Value: 10µF; Applications: General Purpose; Capacitance: 10µF; ComponentLink1Description: Datasheet; ComponentLink1URL: https://www.yageo.com/upload/media/product/productsearch/datasheet/mlcc/UPY-GPHC_X5R_4V-to-50V_25.pdf; ComponentLink2Description: DigiKey Link; ComponentLink2URL: http://digikey.com/product-detail/en/yageo/CC0805KKX5R7BB106/311-1865-1-ND/5195767; Device Package: 0805 (2012 Metric); LastUpdated: 9/2/2020 1:04:30 AM; Lifecycle Status: Active; Minimum Order: 1; Mounting Type: Surface Mount, MLCC; Operating Temperature: -55°C ~ 85°C; Package / Case: 0805 (2012 Metric); Packaging: TapeAndReel; PartId: 8867; Part Status: Active; Price: 0.09; Series: CC; Size / Dimension: 0.079" L x 0.049" W (2.00mm x 1.25mm); Supplier 1: DigiKey; Supplier Part Number 1: 311-1865-1-ND; Temperature Coefficient: X5R; Thickness (Max): 0.057" (1.45mm); Voltage - Rated: 16V
C76 = CL21A226KPCLRNC: as C23 on sheet NetworkSwitch; Part Number: CL21A226KPCLRNC; Value: 22µF; Applications: General Purpose; Capacitance: 22µF; ComponentLink1Description: Datasheet; ComponentLink1URL: http://www.samsungsem.com/kr/support/product-search/mlcc/CL21A226KPCLRNC.jsp; ComponentLink2Description: DigiKey Link; ComponentLink2URL: http://digikey.com/product-detail/en/samsung-electro-mechanics/CL21A226KPCLRNC/1276-6786-1-ND/5961645; Device Package: 0805 (2012 Metric); Features: Low Profile; LastUpdated: 9/2/2020 1:04:38 AM; Lifecycle Status: Active; Minimum Order: 1; Mounting Type: Surface Mount, MLCC; Operating Temperature: -55°C ~ 85°C; Package / Case: 0805 (2012 Metric); Packaging: TapeAndReel; PartId: 4833; Part Status: Active; Price: 0.08; Series: CL; Size / Dimension: 0.079" L x 0.049" W (2.00mm x 1.25mm); Supplier 1: DigiKey; Supplier Part Number 1: 1276-6786-1-ND; Temperature Coefficient: X5R; Thickness (Max): 0.037" (0.95mm); Voltage - Rated: 10V
C89 C90 = CL10C240JB8NNNC: CAP CER 24PF 50V C0G/NP0 0603; Manufacturer: Samsung Electro-Mechanics; Temperature Coefficient: C0G, NP0; Tolerance: ±5%; Part Number: CL10C240JB8NNNC; Value: 24pF; Applications: General Purpose; Capacitance: 24pF; ComponentLink1Description: Datasheet; ComponentLink1URL: http://www.samsungsem.com/kr/support/product-search/mlcc/CL10C240JB8NNNC.jsp; ComponentLink2Description: DigiKey Link; ComponentLink2URL: http://digikey.com/product-detail/en/samsung-electro-mechanics/CL10C240JB8NNNC/1276-1761-1-ND/3889847; Device Package: 0603 (1608 Metric); LastUpdated: 9/2/2020 1:03:22 AM; Lifecycle Status: Active; Minimum Order: 1; Mounting Type: Surface Mount, MLCC; Operating Temperature: -55°C ~ 125°C; Package / Case: 0603 (1608 Metric); Packaging: TapeAndReel; PartId: 10003; Part Status: Active; Price: 0.01; Series: CL; Size / Dimension: 0.063" L x 0.031" W (1.60mm x 0.80mm); Supplier 1: DigiKey; Supplier Part Number 1: 1276-1761-1-ND; Thickness (Max): 0.035" (0.90mm); Voltage - Rated: 50V
R62-R65 = RMCF0603FT22R0: as R69 on sheet NetworkSwitch; Part Number: RMCF0603FT22R0; Value: 22 Ohms; ComponentLink1Description: Datasheet; ComponentLink1URL: https://www.seielect.com/catalog/sei-packaging.pdf; ComponentLink2Description: DigiKey Link; ComponentLink2URL: http://digikey.com/product-detail/en/stackpole-electronics-inc/RMCF0603FT22R0/RMCF0603FT22R0CT-ND/1942946; Composition: Thick Film; Device Package: 0603 (1608 Metric); Features: Automotive AEC-Q200; Height - Seated (Max): 0.022" (0.55mm); LastUpdated: 9/2/2020 1:10:13 AM; Lifecycle Status: Active; Minimum Order: 1; Number of Terminations: 2; Operating Temperature: -55°C ~ 155°C; Package / Case: 0603 (1608 Metric); Packaging: CutTape; PartId: 10611; Part Status: Active; Price: 0.10; Ratings: AEC-Q200; Resistance: 22 Ohms; Series: RMCF; Size / Dimension: 0.061" L x 0.031" W (1.55mm x 0.80mm); Supplier 1: DigiKey; Supplier Part Number 1: RMCF0603FT22R0CT-ND; Supplier Device Package: 0603; Tolerance: ±1%
R129 R131 R135 = RMCF0603JT10K0: as R57 on sheet NetworkSwitch; Part Number: RMCF0603JT10K0; Value: 10 kOhms; ComponentLink1Description: Datasheet; ComponentLink1URL: https://www.seielect.com/catalog/sei-packaging.pdf; ComponentLink2Description: DigiKey Link; ComponentLink2URL: http://digikey.com/product-detail/en/stackpole-electronics-inc/RMCF0603JT10K0/RMCF0603JT10K0CT-ND/1943191; Composition: Thick Film; Device Package: 0603 (1608 Metric); Features: Automotive AEC-Q200; Height - Seated (Max): 0.022" (0.55mm); LastUpdated: 9/2/2020 1:09:31 AM; Lifecycle Status: Active; Minimum Order: 1; Number of Terminations: 2; Operating Temperature: -55°C ~ 155°C; Package / Case: 0603 (1608 Metric); Packaging: CutTape; PartId: 25659; Part Status: Active; Price: 0.10; Ratings: AEC-Q200; Resistance: 10 kOhms; Series: RMCF; Size / Dimension: 0.061" L x 0.031" W (1.55mm x 0.80mm); Supplier 1: DigiKey; Supplier Part Number 1: RMCF0603JT10K0CT-ND; Supplier Device Package: 0603; Tolerance: ±5%
R130 R132 = RMCF0603FT330R: RES 330 OHM 1% 1/10W 0603; Manufacturer: Stackpole Electronics Inc; Power (Watts): 0.1W, 1/10W; Temperature Coefficient: ±100ppm/°C; Part Number: RMCF0603FT330R; Value: 330 Ohms; ComponentLink1Description: Datasheet; ComponentLink1URL: https://www.seielect.com/catalog/sei-rmcf_rmcp.pdf; ComponentLink2Description: DigiKey Link; ComponentLink2URL: http://digikey.com/product-detail/en/stackpole-electronics-inc/RMCF0603FT330R/RMCF0603FT330RCT-ND/1942981; Composition: Thick Film; Device Package: 0603 (1608 Metric); Features: Automotive AEC-Q200; Height - Seated (Max): 0.022" (0.55mm); LastUpdated: 9/2/2020 1:10:13 AM; Lifecycle Status: Active; Minimum Order: 1; Number of Terminations: 2; Operating Temperature: -55°C ~ 155°C; Package / Case: 0603 (1608 Metric); Packaging: CutTape; PartId: 10615; Part Status: Active; Price: 0.10; Ratings: AEC-Q200; Resistance: 330 Ohms; Series: RMCF; Size / Dimension: 0.061" L x 0.031" W (1.55mm x 0.80mm); Supplier 1: DigiKey; Supplier Part Number 1: RMCF0603FT330RCT-ND; Supplier Device Package: 0603; Tolerance: ±1%
R133 = RMCF0603FT200R: RES 200 OHM 1% 1/10W 0603; Manufacturer: Stackpole Electronics Inc; Power (Watts): 0.1W, 1/10W; Temperature Coefficient: ±100ppm/°C; Part Number: RMCF0603FT200R; Value: 200 Ohms; ComponentLink1Description: Datasheet; ComponentLink1URL: https://www.seielect.com/catalog/sei-packaging.pdf; ComponentLink2Description: DigiKey Link; ComponentLink2URL: http://digikey.com/product-detail/en/stackpole-electronics-inc/RMCF0603FT200R/RMCF0603FT200RCT-ND/1942972; Composition: Thick Film; Device Package: 0603 (1608 Metric); Features: Automotive AEC-Q200; Height - Seated (Max): 0.022" (0.55mm); LastUpdated: 9/2/2020 1:10:13 AM; Lifecycle Status: Active; Minimum Order: 1; Number of Terminations: 2; Operating Temperature: -55°C ~ 155°C; Package / Case: 0603 (1608 Metric); Packaging: CutTape; PartId: 10703; Part Status: Active; Price: 0.10; Ratings: AEC-Q200; Resistance: 200 Ohms; Series: RMCF; Size / Dimension: 0.061" L x 0.031" W (1.55mm x 0.80mm); Supplier 1: DigiKey; Supplier Part Number 1: RMCF0603FT200RCT-ND; Supplier Device Package: 0603; Tolerance: ±1%
R134 = RMCF0603FT6K04: as R66 on sheet NetworkSwitch; Part Number: RMCF0603FT6K04; Value: 6.04 kOhms; ComponentLink1Description: Datasheet; ComponentLink1URL: https://www.seielect.com/catalog/sei-rmcf_rmcp.pdf; ComponentLink2Description: DigiKey Link; ComponentLink2URL: http://digikey.com/product-detail/en/stackpole-electronics-inc/RMCF0603FT6K04/RMCF0603FT6K04CT-ND/1943041; Composition: Thick Film; Device Package: 0603 (1608 Metric); Features: Automotive AEC-Q200; Height - Seated (Max): 0.022" (0.55mm); LastUpdated: 9/2/2020 1:10:13 AM; Lifecycle Status: Active; Minimum Order: 1; Number of Terminations: 2; Operating Temperature: -55°C ~ 155°C; Package / Case: 0603 (1608 Metric); Packaging: CutTape; PartId: 10873; Part Status: Active; Price: 0.10; Ratings: AEC-Q200; Resistance: 6.04 kOhms; Series: RMCF; Size / Dimension: 0.061" L x 0.031" W (1.55mm x 0.80mm); Supplier 1: DigiKey; Supplier Part Number 1: RMCF0603FT6K04CT-ND; Supplier Device Package: 0603; Tolerance: ±1%
Y3 = TSX-3225 25.0000MF20P-C0: CRYSTAL 25.0000MHZ 18PF SMD; Manufacturer: EPSON; ESR (Equivalent Series Resistance): 40 Ohms; Frequency Stability: ±20ppm; Frequency Tolerance: ±10ppm; Operating Mode: Fundamental; Part Number: TSX-3225 25.0000MF20P-C0; ComponentLink1Description: Datasheet; ComponentLink1URL: https://support.epson.biz/td/api/doc_check.php?dl=brief_TSX-3225&lang=en; ComponentLink2Description: DigiKey Link; ComponentLink2URL: http://digikey.com/product-detail/en/epson/TSX-3225-25.0000MF20P-C0/SER4212CT-ND/7430967; Frequency: 25MHz; Height - Seated (Max): 0.024" (0.60mm); LastUpdated: 9/2/2020 1:21:54 AM; Lifecycle Status: Active; Load Capacitance: 18pF; Minimum Order: 1; Mounting Type: Surface Mount; Operating Temperature: -20°C ~ 85°C; Package / Case: 4-SMD, No Lead; Packaging: TapeAndReel; PartId: 447; Part Status: Active; Price: 0.18; Series: TSX-3225; Size / Dimension: 0.126" L x 0.098" W (3.20mm x 2.50mm); Supplier 1: DigiKey; Supplier Part Number 1: SER4212CT-ND; Type: MHz Crystal; Value: 25MHz
U16 = SCH - CONTROLLER - ETHERNET - MICROCHIP LAN7431: Supplier 1: Mouser